# Altium schematic sheet TSK3000_Load_From_Flash.SchDoc: FPGA TSK3000 Load From Flash example
size C; Organization: Altium Limited; Address1: L3, 12a Rodborough Rd; Address2: Frenchs Forest; Address3: NSW; Address4: Australia 2086; DocumentNumber: 1; SheetNumber: 1; SheetTotal: 1
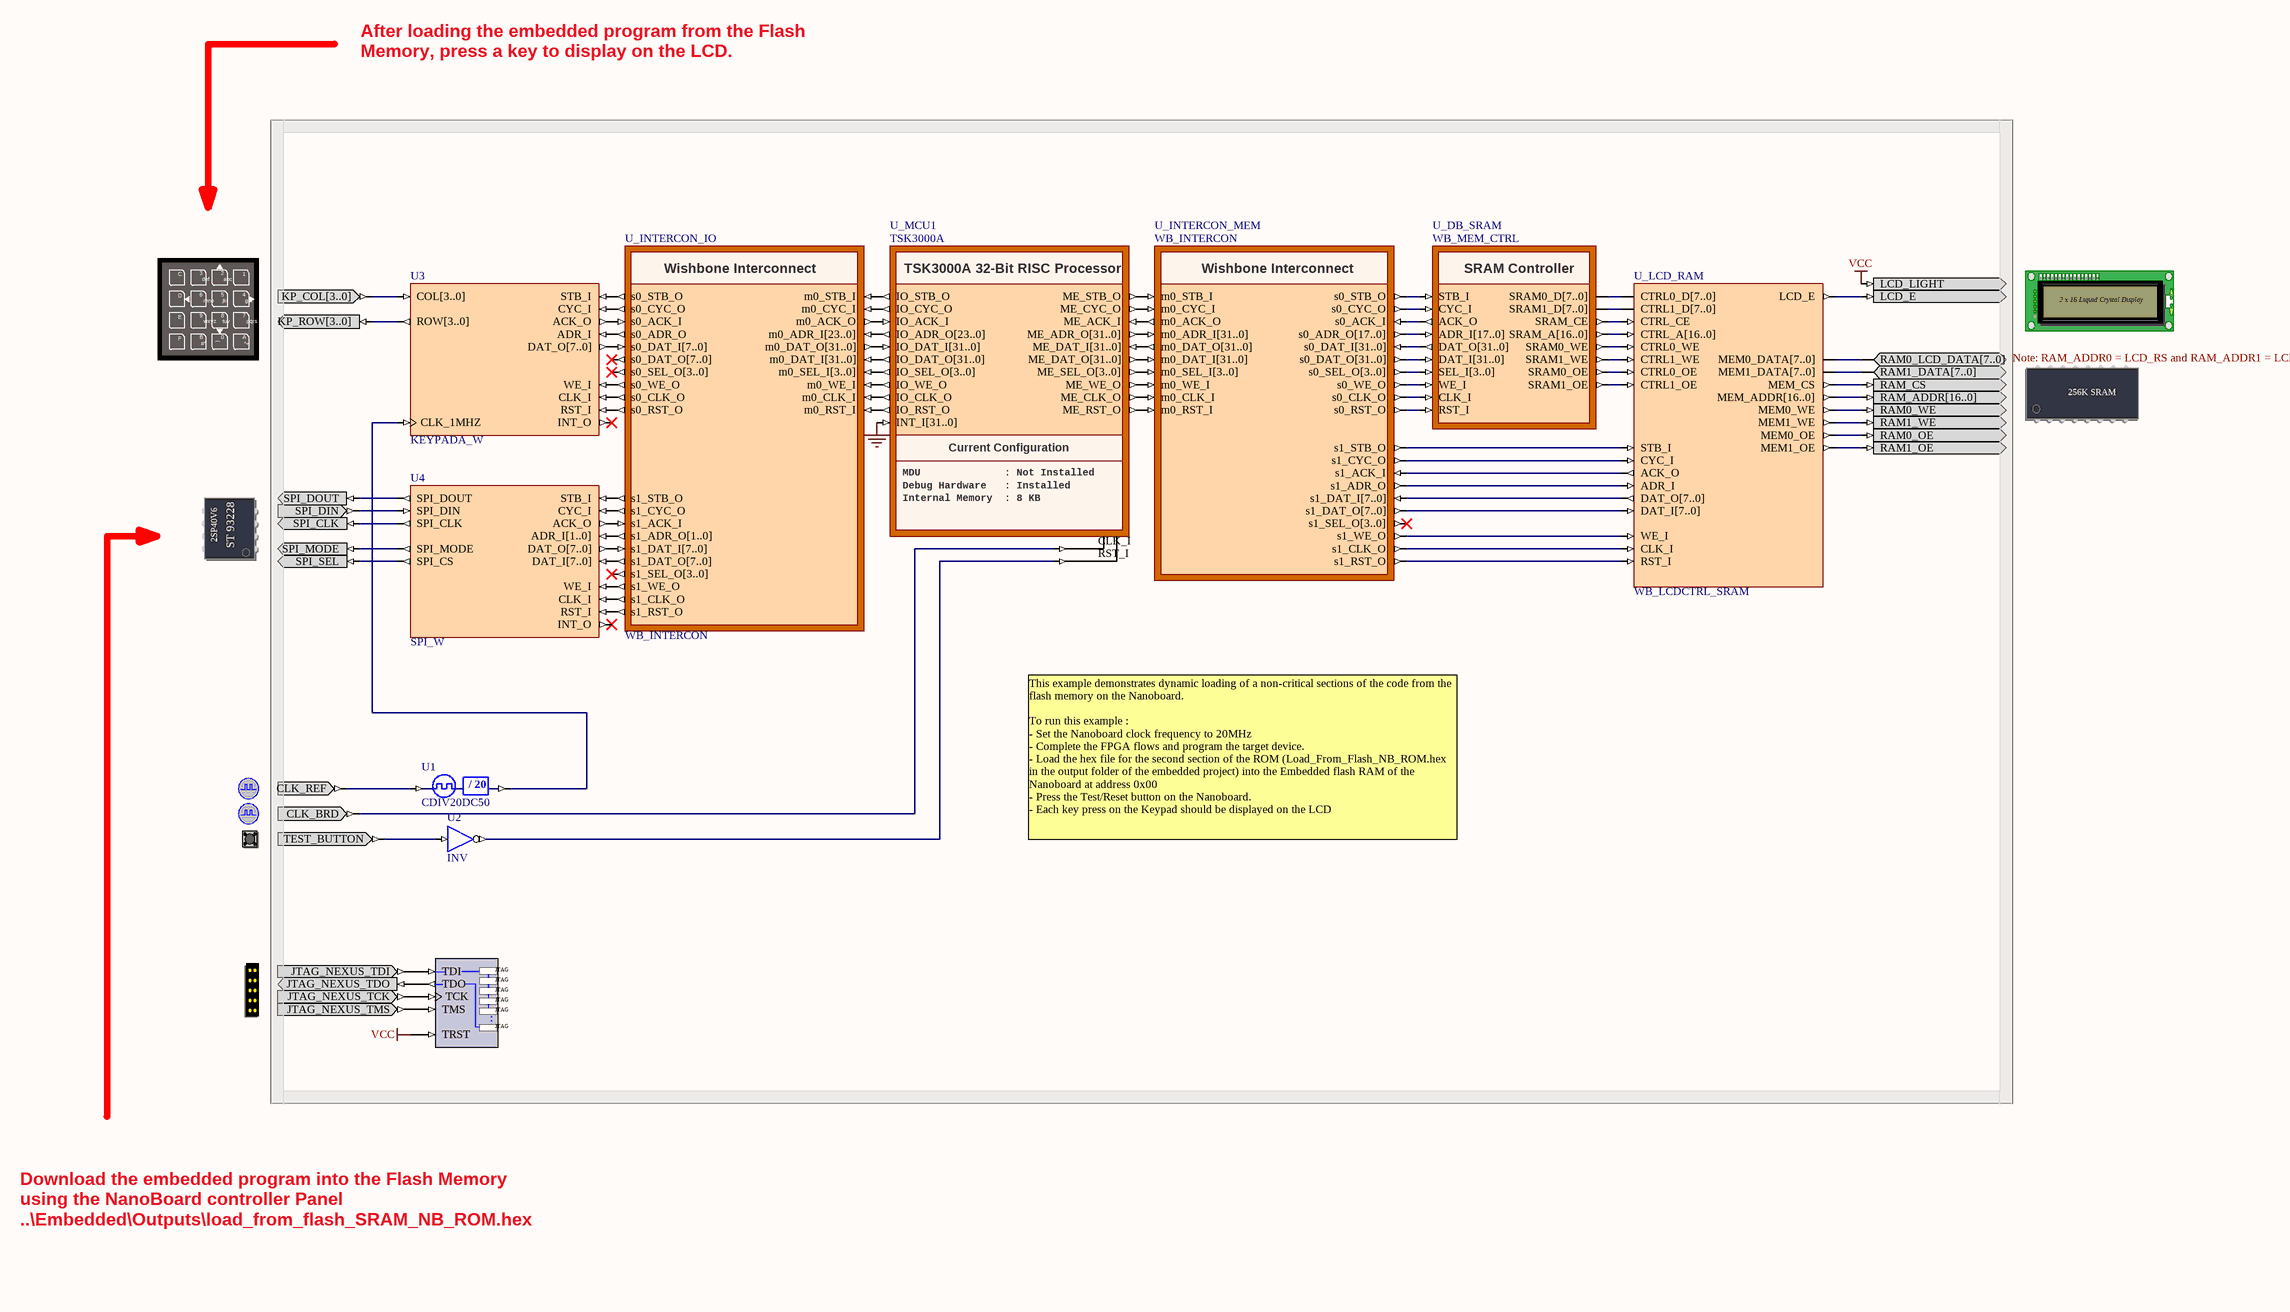
[diagram p0: TSK3000_Load_From_Flash.SchDoc]

## Parts
(Parts that share a designator on the sheet are numbered #1, #2 ... from top to bottom, then left to right.)
?#1  Note: RAM_ADDR0 = LCD_RS and RAM_ADDR1 = LCD_RW  (hidden comment: LCD_MEMORY256KX8)
?#2  KEYPAD  (value not drawn)
?#3  SERIALFMEMORY  (value not drawn)
?#4  CLOCK_REFERENCE  (value not drawn)
?#5  CLOCK_BOARD  (value not drawn)
?#6  TEST_BUTTON  (value not drawn)
?#7  NEXUS_JTAG_CONNECTOR  (value not drawn)
NEXUS_JTAG_PORT  NEXUS_JTAG_PORT  (value not drawn)
U1  CDIV20DC50
U2  INV
U3  KEYPADA_W
U4  SPI_W
U_DB_SRAM  WB_MEM_CTRL
U_INTERCON_IO  WB_INTERCON
U_INTERCON_MEM  WB_INTERCON
U_LCD_RAM  WB_LCDCTRL_SRAM
U_MCU1  TSK3000A

## Nets
GNDBUS[..]: U_MCU1.INT_I[31..0]
VCC: ?#1.LCD_LIGHT NEXUS_JTAG_PORT.TRST
Net?#1_LCD_E: ?#1.LCD_E U_LCD_RAM.LCD_E
Net?#1_RAM0_LCD_DATA[7..0]: ?#1.RAM0_LCD_DATA[7..0] U_LCD_RAM.MEM0_DATA[7..0]
Net?#1_RAM0_OE: ?#1.RAM0_OE U_LCD_RAM.MEM0_OE
Net?#1_RAM0_WE: ?#1.RAM0_WE U_LCD_RAM.MEM0_WE
Net?#1_RAM1_DATA[7..0]: ?#1.RAM1_DATA[7..0] U_LCD_RAM.MEM1_DATA[7..0]
Net?#1_RAM1_OE: ?#1.RAM1_OE U_LCD_RAM.MEM1_OE
Net?#1_RAM1_WE: ?#1.RAM1_WE U_LCD_RAM.MEM1_WE
Net?#1_RAM_ADDR[16..0]: ?#1.RAM_ADDR[16..0] U_LCD_RAM.MEM_ADDR[16..0]
Net?#1_RAM_CS: ?#1.RAM_CS U_LCD_RAM.MEM_CS
Net?#2_KP_COL[3..0]: ?#2.KP_COL[3..0] U3.COL[3..0]
Net?#2_KP_ROW[3..0]: ?#2.KP_ROW[3..0] U3.ROW[3..0]
Net?#3_SPI_CLK: ?#3.SPI_CLK U4.SPI_CLK
Net?#3_SPI_DIN: ?#3.SPI_DIN U4.SPI_DIN
Net?#3_SPI_DOUT: ?#3.SPI_DOUT U4.SPI_DOUT
Net?#3_SPI_MODE: ?#3.SPI_MODE U4.SPI_MODE
Net?#3_SPI_SEL: ?#3.SPI_SEL U4.SPI_CS
Net?#4_CLK_REF: ?#4.CLK_REF U1.CLKIN
Net?#5_CLK_BRD: ?#5.CLK_BRD U_MCU1.CLK_I
Net?#6_TEST_BUTTON: ?#6.TEST_BUTTON U2.I
Net?#7_JTAG_NEXUS_TCK: ?#7.JTAG_NEXUS_TCK NEXUS_JTAG_PORT.TCK
Net?#7_JTAG_NEXUS_TDI: ?#7.JTAG_NEXUS_TDI NEXUS_JTAG_PORT.TDI
Net?#7_JTAG_NEXUS_TDO: ?#7.JTAG_NEXUS_TDO NEXUS_JTAG_PORT.TDO
Net?#7_JTAG_NEXUS_TMS: ?#7.JTAG_NEXUS_TMS NEXUS_JTAG_PORT.TMS
NetU1_CLKDV: U1.CLKDV U3.CLK_1MHZ
NetU2_O: U2.O U_MCU1.RST_I
NetU3_ACK_O: U3.ACK_O U_INTERCON_IO.s0_ACK_I
NetU3_ADR_I: U3.ADR_I U_INTERCON_IO.s0_ADR_O
NetU3_CLK_I: U3.CLK_I U_INTERCON_IO.s0_CLK_O
NetU3_CYC_I: U3.CYC_I U_INTERCON_IO.s0_CYC_O
NetU3_DAT_O[7..0]: U3.DAT_O[7..0] U_INTERCON_IO.s0_DAT_I[7..0]
NetU3_RST_I: U3.RST_I U_INTERCON_IO.s0_RST_O
NetU3_STB_I: U3.STB_I U_INTERCON_IO.s0_STB_O
NetU3_WE_I: U3.WE_I U_INTERCON_IO.s0_WE_O
NetU4_ACK_O: U4.ACK_O U_INTERCON_IO.s1_ACK_I
NetU4_ADR_I[1..0]: U4.ADR_I[1..0] U_INTERCON_IO.s1_ADR_O[1..0]
NetU4_CLK_I: U4.CLK_I U_INTERCON_IO.s1_CLK_O
NetU4_CYC_I: U4.CYC_I U_INTERCON_IO.s1_CYC_O
NetU4_DAT_I[7..0]: U4.DAT_I[7..0] U_INTERCON_IO.s1_DAT_O[7..0]
NetU4_DAT_O[7..0]: U4.DAT_O[7..0] U_INTERCON_IO.s1_DAT_I[7..0]
NetU4_RST_I: U4.RST_I U_INTERCON_IO.s1_RST_O
NetU4_STB_I: U4.STB_I U_INTERCON_IO.s1_STB_O
NetU4_WE_I: U4.WE_I U_INTERCON_IO.s1_WE_O
NetU_DB_SRAM_ACK_O: U_DB_SRAM.ACK_O U_INTERCON_MEM.s0_ACK_I
NetU_DB_SRAM_ADR_I[17..0]: U_DB_SRAM.ADR_I[17..0] U_INTERCON_MEM.s0_ADR_O[17..0]
NetU_DB_SRAM_CLK_I: U_DB_SRAM.CLK_I U_INTERCON_MEM.s0_CLK_O
NetU_DB_SRAM_CYC_I: U_DB_SRAM.CYC_I U_INTERCON_MEM.s0_CYC_O
NetU_DB_SRAM_DAT_I[31..0]: U_DB_SRAM.DAT_I[31..0] U_INTERCON_MEM.s0_DAT_O[31..0]
NetU_DB_SRAM_DAT_O[31..0]: U_DB_SRAM.DAT_O[31..0] U_INTERCON_MEM.s0_DAT_I[31..0]
NetU_DB_SRAM_RST_I: U_DB_SRAM.RST_I U_INTERCON_MEM.s0_RST_O
NetU_DB_SRAM_SEL_I[3..0]: U_DB_SRAM.SEL_I[3..0] U_INTERCON_MEM.s0_SEL_O[3..0]
NetU_DB_SRAM_SRAM0_D[7..0]: U_DB_SRAM.SRAM0_D[7..0] U_LCD_RAM.CTRL0_D[7..0]
NetU_DB_SRAM_SRAM0_OE: U_DB_SRAM.SRAM0_OE U_LCD_RAM.CTRL0_OE
NetU_DB_SRAM_SRAM0_WE: U_DB_SRAM.SRAM0_WE U_LCD_RAM.CTRL0_WE
NetU_DB_SRAM_SRAM1_D[7..0]: U_DB_SRAM.SRAM1_D[7..0] U_LCD_RAM.CTRL1_D[7..0]
NetU_DB_SRAM_SRAM1_OE: U_DB_SRAM.SRAM1_OE U_LCD_RAM.CTRL1_OE
NetU_DB_SRAM_SRAM1_WE: U_DB_SRAM.SRAM1_WE U_LCD_RAM.CTRL1_WE
NetU_DB_SRAM_SRAM_A[16..0]: U_DB_SRAM.SRAM_A[16..0] U_LCD_RAM.CTRL_A[16..0]
NetU_DB_SRAM_SRAM_CE: U_DB_SRAM.SRAM_CE U_LCD_RAM.CTRL_CE
NetU_DB_SRAM_STB_I: U_DB_SRAM.STB_I U_INTERCON_MEM.s0_STB_O
NetU_DB_SRAM_WE_I: U_DB_SRAM.WE_I U_INTERCON_MEM.s0_WE_O
NetU_INTERCON_IO_m0_ACK_O: U_INTERCON_IO.m0_ACK_O U_MCU1.IO_ACK_I
NetU_INTERCON_IO_m0_ADR_I[23..0]: U_INTERCON_IO.m0_ADR_I[23..0] U_MCU1.IO_ADR_O[23..0]
NetU_INTERCON_IO_m0_CLK_I: U_INTERCON_IO.m0_CLK_I U_MCU1.IO_CLK_O
NetU_INTERCON_IO_m0_CYC_I: U_INTERCON_IO.m0_CYC_I U_MCU1.IO_CYC_O
NetU_INTERCON_IO_m0_DAT_I[31..0]: U_INTERCON_IO.m0_DAT_I[31..0] U_MCU1.IO_DAT_O[31..0]
NetU_INTERCON_IO_m0_DAT_O[31..0]: U_INTERCON_IO.m0_DAT_O[31..0] U_MCU1.IO_DAT_I[31..0]
NetU_INTERCON_IO_m0_RST_I: U_INTERCON_IO.m0_RST_I U_MCU1.IO_RST_O
NetU_INTERCON_IO_m0_SEL_I[3..0]: U_INTERCON_IO.m0_SEL_I[3..0] U_MCU1.IO_SEL_O[3..0]
NetU_INTERCON_IO_m0_STB_I: U_INTERCON_IO.m0_STB_I U_MCU1.IO_STB_O
NetU_INTERCON_IO_m0_WE_I: U_INTERCON_IO.m0_WE_I U_MCU1.IO_WE_O
NetU_INTERCON_MEM_m0_ACK_O: U_INTERCON_MEM.m0_ACK_O U_MCU1.ME_ACK_I
NetU_INTERCON_MEM_m0_ADR_I[31..0]: U_INTERCON_MEM.m0_ADR_I[31..0] U_MCU1.ME_ADR_O[31..0]
NetU_INTERCON_MEM_m0_CLK_I: U_INTERCON_MEM.m0_CLK_I U_MCU1.ME_CLK_O
NetU_INTERCON_MEM_m0_CYC_I: U_INTERCON_MEM.m0_CYC_I U_MCU1.ME_CYC_O
NetU_INTERCON_MEM_m0_DAT_I[31..0]: U_INTERCON_MEM.m0_DAT_I[31..0] U_MCU1.ME_DAT_O[31..0]
NetU_INTERCON_MEM_m0_DAT_O[31..0]: U_INTERCON_MEM.m0_DAT_O[31..0] U_MCU1.ME_DAT_I[31..0]
NetU_INTERCON_MEM_m0_RST_I: U_INTERCON_MEM.m0_RST_I U_MCU1.ME_RST_O
NetU_INTERCON_MEM_m0_SEL_I[3..0]: U_INTERCON_MEM.m0_SEL_I[3..0] U_MCU1.ME_SEL_O[3..0]
NetU_INTERCON_MEM_m0_STB_I: U_INTERCON_MEM.m0_STB_I U_MCU1.ME_STB_O
NetU_INTERCON_MEM_m0_WE_I: U_INTERCON_MEM.m0_WE_I U_MCU1.ME_WE_O
NetU_INTERCON_MEM_s1_ACK_I: U_INTERCON_MEM.s1_ACK_I U_LCD_RAM.ACK_O
NetU_INTERCON_MEM_s1_ADR_O: U_INTERCON_MEM.s1_ADR_O U_LCD_RAM.ADR_I
NetU_INTERCON_MEM_s1_CLK_O: U_INTERCON_MEM.s1_CLK_O U_LCD_RAM.CLK_I
NetU_INTERCON_MEM_s1_CYC_O: U_INTERCON_MEM.s1_CYC_O U_LCD_RAM.CYC_I
NetU_INTERCON_MEM_s1_DAT_I[7..0]: U_INTERCON_MEM.s1_DAT_I[7..0] U_LCD_RAM.DAT_O[7..0]
NetU_INTERCON_MEM_s1_DAT_O[7..0]: U_INTERCON_MEM.s1_DAT_O[7..0] U_LCD_RAM.DAT_I[7..0]
NetU_INTERCON_MEM_s1_RST_O: U_INTERCON_MEM.s1_RST_O U_LCD_RAM.RST_I
NetU_INTERCON_MEM_s1_STB_O: U_INTERCON_MEM.s1_STB_O U_LCD_RAM.STB_I
NetU_INTERCON_MEM_s1_WE_O: U_INTERCON_MEM.s1_WE_O U_LCD_RAM.WE_I

Not connected (* = marked no-connect by the designer): U3 INT_O*; U4 INT_O*; U_INTERCON_IO s0_DAT_O[7..0]* s0_SEL_O[3..0]* s1_SEL_O[3..0]*; U_INTERCON_MEM s1_SEL_O[3..0]*

## Notes on the sheet
- After loading the embedded program from the Flash Memory, press a key to display on the LCD.
- This example demonstrates dynamic loading of a non-critical sections of the code from the flash memory on the Nanoboard.
  To run this example :
  - Set the Nanoboard clock frequency to 20MHz
  - Complete the FPGA flows and program the target device.
  - Load the hex file for the second section of the ROM (Load_From_Flash_NB_ROM.hex in the output folder of the embedded project) into the Embedded flash RAM of the Nanoboard at address 0x00
  - Press the Test/Reset button on the Nanoboard.
  - Each key press on the Keypad should be displayed on the LCD
- Download the embedded program into the Flash Memory using the NanoBoard controller Panel
  ..\Embedded\Outputs\load_from_flash_SRAM_NB_ROM.hex
- Title
- Size:
- Date:
- File:
- C
- Number:
- Time:
- Revision:
- Sheet
- of
- (in symbol CDIV20DC50) / 20
- (in symbol KEYPAD) C; 3; 2; 1; def; abc; 6; 5; 4; D; mno; jkl; ghi; E; 9; 8; 7; wxyz; tuv; pqrs; F; B; 0; A; #^; (; *+
- (in symbol LCD_MEMORY256KX8) 2 x 16 Liquid Crystal Display; 256K SRAM
- (in symbol NEXUS_JTAG_PORT) .
- (in symbol SERIALFMEMORY) 2SP40V6; ST 93228
- (in symbol TSK3000A) TSK3000A 32-Bit RISC Processor; Current Configuration; MDU              : Not Installed; Debug Hardware   : Installed; Internal Memory  : 8 KB
- (in symbol WB_INTERCON) Wishbone Interconnect
- (in symbol WB_MEM_CTRL) SRAM Controller

## Library data of the parts
?#1 = LCD_MEMORY256KX8: Liquid Crystal Display  and SRAM 256kx8; PortComponent: True; Published: 19-Nov-2003; Publisher: Altium Limited; HelpURL: TR0102 NanoBoard Technical Reference Manual - NB1.pdf#page=39
?#2 = KEYPAD: Key Pad; PortComponent: True; Published: 19-Nov-2003; Publisher: Altium Limited; HelpURL: TR0102 NanoBoard Technical Reference Manual - NB1.pdf#page=40
?#3 = SERIALFMEMORY: Serial Flash Memory; PortComponent: True; Published: 19-Nov-2003; Publisher: Altium Limited; HelpURL: TR0102 NanoBoard Technical Reference Manual - NB1.pdf#page=34
?#4 = CLOCK_REFERENCE: Global System Clock Reference Supply; PortComponent: True; Published: 19-Nov-2003; Publisher: Altium Limited; HelpURL: TR0102 NanoBoard Technical Reference Manual - NB1.pdf#page=29
?#5 = CLOCK_BOARD: Global System Clock Supply; PortComponent: True; Published: 19-Nov-2003; Publisher: Altium Limited; HelpURL: TR0102 NanoBoard Technical Reference Manual - NB1.pdf#page=29
?#6 = TEST_BUTTON: Test Button; PortComponent: True; Published: 19-Nov-2003; Publisher: Altium Limited; HelpURL: TR0102 NanoBoard Technical Reference Manual - NB1.pdf#page=41
?#7 = NEXUS_JTAG_CONNECTOR: JTAG Port; PortComponent: True; Published: 19-Nov-2003; Publisher: Altium Limited; HelpURL: TR0102 NanoBoard Technical Reference Manual - NB1.pdf#page=33
NEXUS_JTAG_PORT = NEXUS_JTAG_PORT: Soft Nexus-Chain Connector; NEXUS_JTAG_CONNECTOR: True; FunctionalClass: JTAG; Published: 29-Jan-2004; Publisher: Altium Limited; LastRevisionNo: 1.00.00; HelpURL: CR0118 FPGA Generic Library Guide.pdf#page=399
U1 = CDIV20DC50: Clock Divider by 20 with 50% Duty Cycle Output; DivisorRate: 20; DutyCycle: 50; ArchiveName: GENERIC; VHDLIB_SIM: GENERIC_LIB; Published: 29-Jan-2004; Publisher: Altium Limited; LastRevisionNo: 1.00.00; HelpURL: CR0118 FPGA Generic Library Guide.pdf#page=142; ComponentLink1URL: CR0127 FPGA Clock Divider Resource Usage.pdf#page=21; ComponentLink1Description: Core &Resource Usage; FunctionalClass: Clock Divider
U2 = INV: Inverter; FunctionalClass: Logic Primitive; ArchiveName: GENERIC; VHDLIB_SIM: GENERIC_LIB; Published: 29-Jan-2004; Publisher: Altium Limited; XilinxEquivalent: INV; LastRevisionNo: 1.00.00; HelpURL: CR0118 FPGA Generic Library Guide.pdf#page=290; ComponentLink1URL: CR0136 FPGA Logic Primitive Resource Usage.pdf#page=61; ComponentLink1Description: Core &Resource Usage; SubClass: INV
U3 = KEYPADA_W: Keypad Wishbone; Published: 9-Dec-2004; Publisher: Altium Limited; LastRevisionNo: 1.00.00; HelpURL: CR0106 Keypad Controller.pdf#page=2; ComponentLink1Description: Core &Resource Usage; ComponentLink1URL: CR0139 FPGA Peripheral Resource Usage.pdf#page=15
U4 = SPI_W: SPI Controller Wishbone; Published: 9-Dec-2004; Publisher: Altium Limited; ComponentLink1Description: Core &Resource Usage; ComponentLink1URL: CR0139 FPGA Peripheral Resource Usage.pdf#page=39; HelpURL: CR0153 SPI_W Serial Peripheral Interface Controller.pdf; LastRevisionNo: 1.05.01; LatestRevisionNote: Correction for the busy signal generation; LatestRevisionDate: 6-Sep-2005
U_DB_SRAM = WB_MEM_CTRL: Configurable Memory Controller; ConfigurationParameters: {}Option_MemoryType[Asynchronous SRAM]{}Option_MemorySize[256 Kb (64K x 32-bit)]{}Option_Layout[2 x  8-bit Wide Devices]{}Option_Read[2]{}Option_WriteSetup[1]{}Option_WritePulse[1]{}Option_WriteHold[1]{}; ComponentLink1Description: Core &Resource Usage; ComponentLink1URL: CR0139 FPGA Peripheral Resource Usage.pdf#page=58; HelpURL: CR0152 WB_MEM_CTRL Configurable Wishbone Memory Controller.pdf#page=2; LastRevisionNo: 1.00.00; Published: 9-Dec-2004; Publisher: Altium Limited; ConfiguratorName: WB_MEM_CTRL
U_INTERCON_IO = WB_INTERCON: Configurable Wishbone Interconnect; ConfigurationParameters: {}UnusedInterrupts[2]{}MasterAddressBits[1]{}Name0[KEYPAD]{}Kind0[0]{}SpaceAfter0[6]{}Address_Base0[0]{}Address_UsedRange0[1]{}Address_Bits0[1]{}Address_Mode0[1]{}Address_DecodeWidth0[4]{}DataWidth0[2]{}UsedInterrupts0[]{}Name1[Nanoboard_SPI]{}Kind1[0]{}SpaceAfter1[4]{}Address_Base1[1048576]{}Address_UsedRange1[1]{}Address_Bits1[2]{}Address_Mode1[0]{}Address_DecodeWidth1[4]{}DataWidth1[2]{}UsedInterrupts1[]; ComponentLink1Description: Core &Resource Usage; ComponentLink1URL: CR0139 FPGA Peripheral Resource Usage.pdf#page=51; HelpURL: CR0150 WB_INTERCON Configurable Wishbone Interconnect.pdf#page=2; LastRevisionNo: 1.00.00; Published: 9-Dec-2004; Publisher: Altium Limited; ConfiguratorName: WB_INTERCON
U_INTERCON_MEM = WB_INTERCON: Configurable Wishbone Interconnect; ConfigurationParameters: {}UnusedInterrupts[2]{}MasterAddressBits[0]{}Name0[SRAM_NB]{}Kind0[2]{}SpaceAfter0[2]{}Address_Base0[16777216]{}Address_UsedRange0[1]{}Address_Bits0[18]{}Address_Mode0[1]{}Address_DecodeWidth0[8]{}DataWidth0[0]{}UsedInterrupts0[]{}Name1[LCD]{}Kind1[2]{}SpaceAfter1[4]{}Address_Base1[-2147483648]{}Address_UsedRange1[1]{}Address_Bits1[1]{}Address_Mode1[0]{}Address_DecodeWidth1[8]{}DataWidth1[2]{}UsedInterrupts1[]; ComponentLink1Description: Core &Resource Usage; ComponentLink1URL: CR0139 FPGA Peripheral Resource Usage.pdf#page=51; HelpURL: CR0150 WB_INTERCON Configurable Wishbone Interconnect.pdf#page=2; LastRevisionNo: 1.00.00; Published: 9-Dec-2004; Publisher: Altium Limited; ConfiguratorName: WB_INTERCON
U_LCD_RAM = WB_LCDCTRL_SRAM: LCD Controller Wishbone; ArchiveName: GENERIC; Published: 9-Dec-2004; Publisher: Altium Limited; ComponentLink1Description: Core &Resource Usage; ComponentLink1URL: CR0139 FPGA Peripheral Resource Usage.pdf#page=57; LastRevisionNo: 1.00.00
U_MCU1 = TSK3000A: TSK3000A OCD Microprocessor; ChildModel1: TSK3000A_MCU; Nexus_JTAG_Device: True; Nexus_Core: Processor_OCDS; Nexus_JTAG_Order: 0; ChildModel2: TSK3000A_MDU; ChildModel3: TSK3000A_OCDS; ChildModel4: TSK3000A_Shift_Barrel; ChildModel5: TSK3000A_Shift_Sequential; ChildModel6: Mult_32x32; ConfigurationParameters: {}Option_Processor[0]{}Option_Memory[3]{}Option_MDU[1]{}Option_OCDS[0]{}Option_Shifter[0]{}Option_InterruptCount[32]{}Option_DebugWhenReset[0]{}; ChildModel7: m33x33; Memory_Configuration: Record[NEXUS_CORE]{}ComponentDesignator[BRAMINTERNAL]{}Memory_Depth[8K]{}Memory_UsageType[rom]{}ProgramDownloadAddress[0]{}Memory_BusType[TSK3000:addr_bus]{}Memory_Mau[8]{}Memory_MatchedComponent[]{}Memory_Description[]{}Memory_FillBitPattern[]{}Memory_Interrupts[]{n}Record[NEXUS_CORE]{}ComponentDesignator[SRAM_NB_ROM]{}Memory_Depth[128K]{}Memory_UsageType[rom]{}ProgramDownloadAddress[0x1000000]{}Memory_BusType[TSK3000:addr_bus]{}Memory_Mau[8]{}Memory_MatchedComponent[]{}Memory_Description[U_INTERCON_MEM]{}Memory_FillBitPattern[]{}Memory_Interrupts[]{n}Record[NEXUS_CORE]{}ComponentDesignator[SRAM_NB_RAM]{}Memory_Depth[128K]{}Memory_UsageType[ram]{}ProgramDownloadAddress[0x1020000]{}Memory_BusType[TSK3000:addr_bus]{}Memory_Mau[8]{}Memory_MatchedComponent[]{}Memory_Description[]{}Memory_FillBitPattern[]{}Memory_Interrupts[]{n}Record[CODE_EXPORT]{}ExportType[1]{n}Record[PERIPHERAL]{}ComponentDesignator[LCD]{}Memory_Depth[0x0002]{}Memory_UsageType[ram]{}ProgramDownloadAddress[0x80000000]{}Memory_BusType[TSK3000:addr_bus]{}Memory_Mau[8]{}Memory_MatchedComponent[]{}Memory_Description[U_INTERCON_MEM]{}Memory_FillBitPattern[]{}Memory_Interrupts[]{n}Record[PERIPHERAL]{}ComponentDesignator[KEYPAD]{}Memory_Depth[0x0001]{}Memory_UsageType[ram]{}ProgramDownloadAddress[0xFF000000]{}Memory_BusType[TSK3000:addr_bus]{}Memory_Mau[8]{}Memory_MatchedComponent[]{}Memory_Description[U_INTERCON_IO]{}Memory_FillBitPattern[]{}Memory_Interrupts[]{n}Record[PERIPHERAL]{}ComponentDesignator[Nanoboard_SPI]{}Memory_Depth[0x0004]{}Memory_UsageType[ram]{}ProgramDownloadAddress[0xFF100000]{}Memory_BusType[TSK3000:addr_bus]{}Memory_Mau[8]{}Memory_MatchedComponent[]{}Memory_Description[U_INTERCON_IO]{}Memory_FillBitPattern[]{}Memory_Interrupts[]{n}; ConfiguratorName: FPGA_MCU32; ProgramLogicalTopAddress: 0; ComponentLink1Description: Core &Resource Usage; ComponentLink1URL: CR0140 FPGA Processor Resource Usage.pdf#page=16; HelpURL: CR0121 TSK3000A 32 bit RISC Processor.pdf#page=6; LastRevisionNo: 1.00.00; Published: 17-Nov-2004; Publisher: Altium Limited